# Altium schematic sheet Top.SchDoc
size A
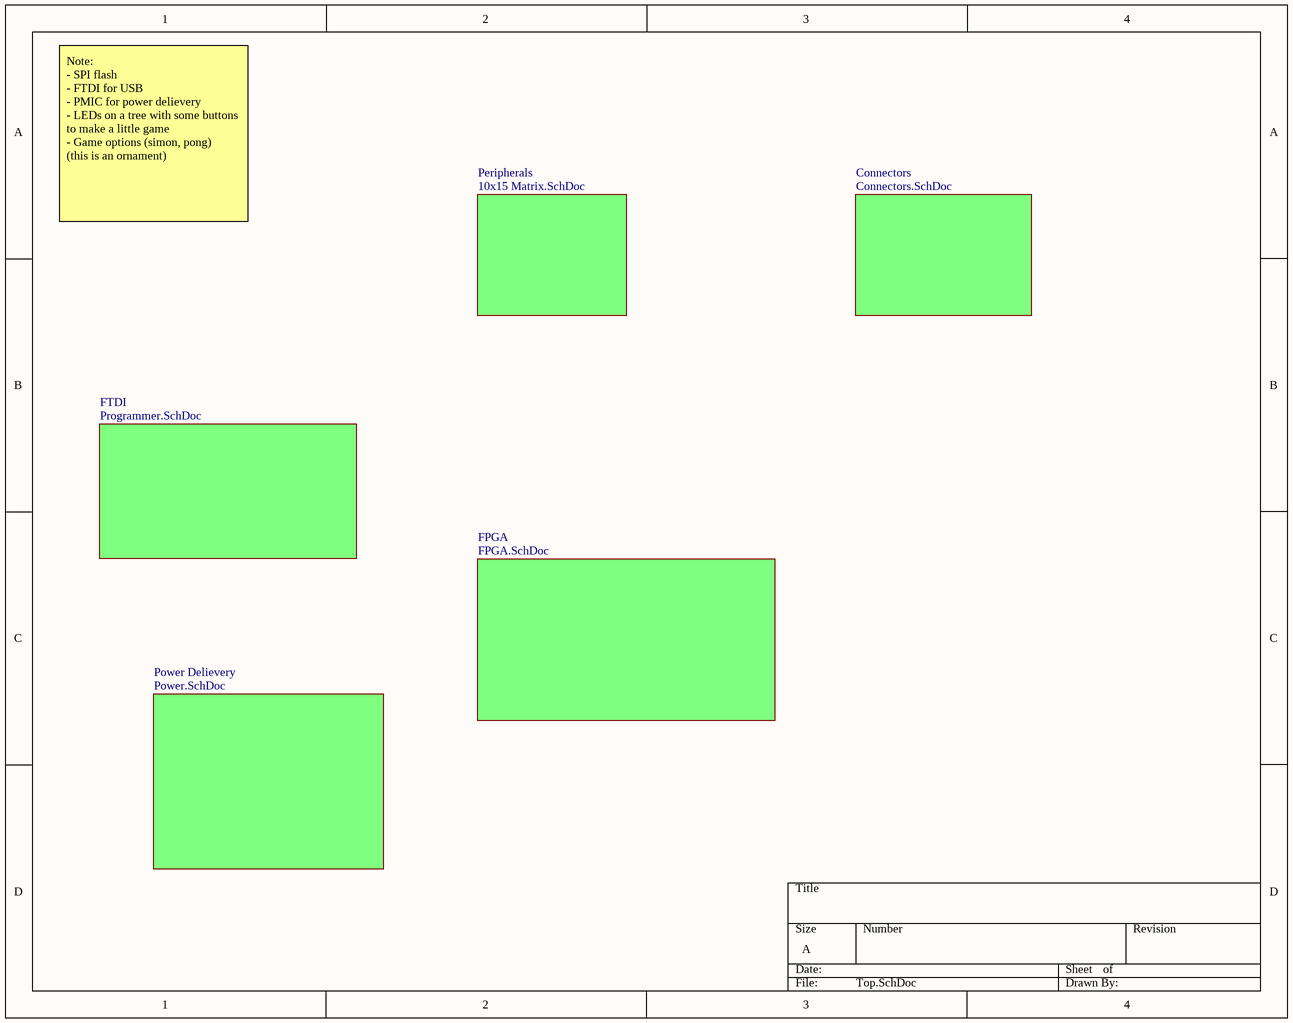
[diagram p0: Top.SchDoc]

## Sub-sheets
Connectors = Connectors.SchDoc: no entries
FPGA = FPGA.SchDoc: no entries
FTDI = Programmer.SchDoc: no entries
Peripherals = 10x15 Matrix.SchDoc: no entries
Power Delievery = Power.SchDoc: no entries

## Notes on the sheet
- Note:
  - SPI flash
  - FTDI for USB
  - PMIC for power delievery
  - LEDs on a tree with some buttons to make a little game
  - Game options (simon, pong)
  (this is an ornament)